# EAGLE schematic 1030-0e (EAGLE 6.0)
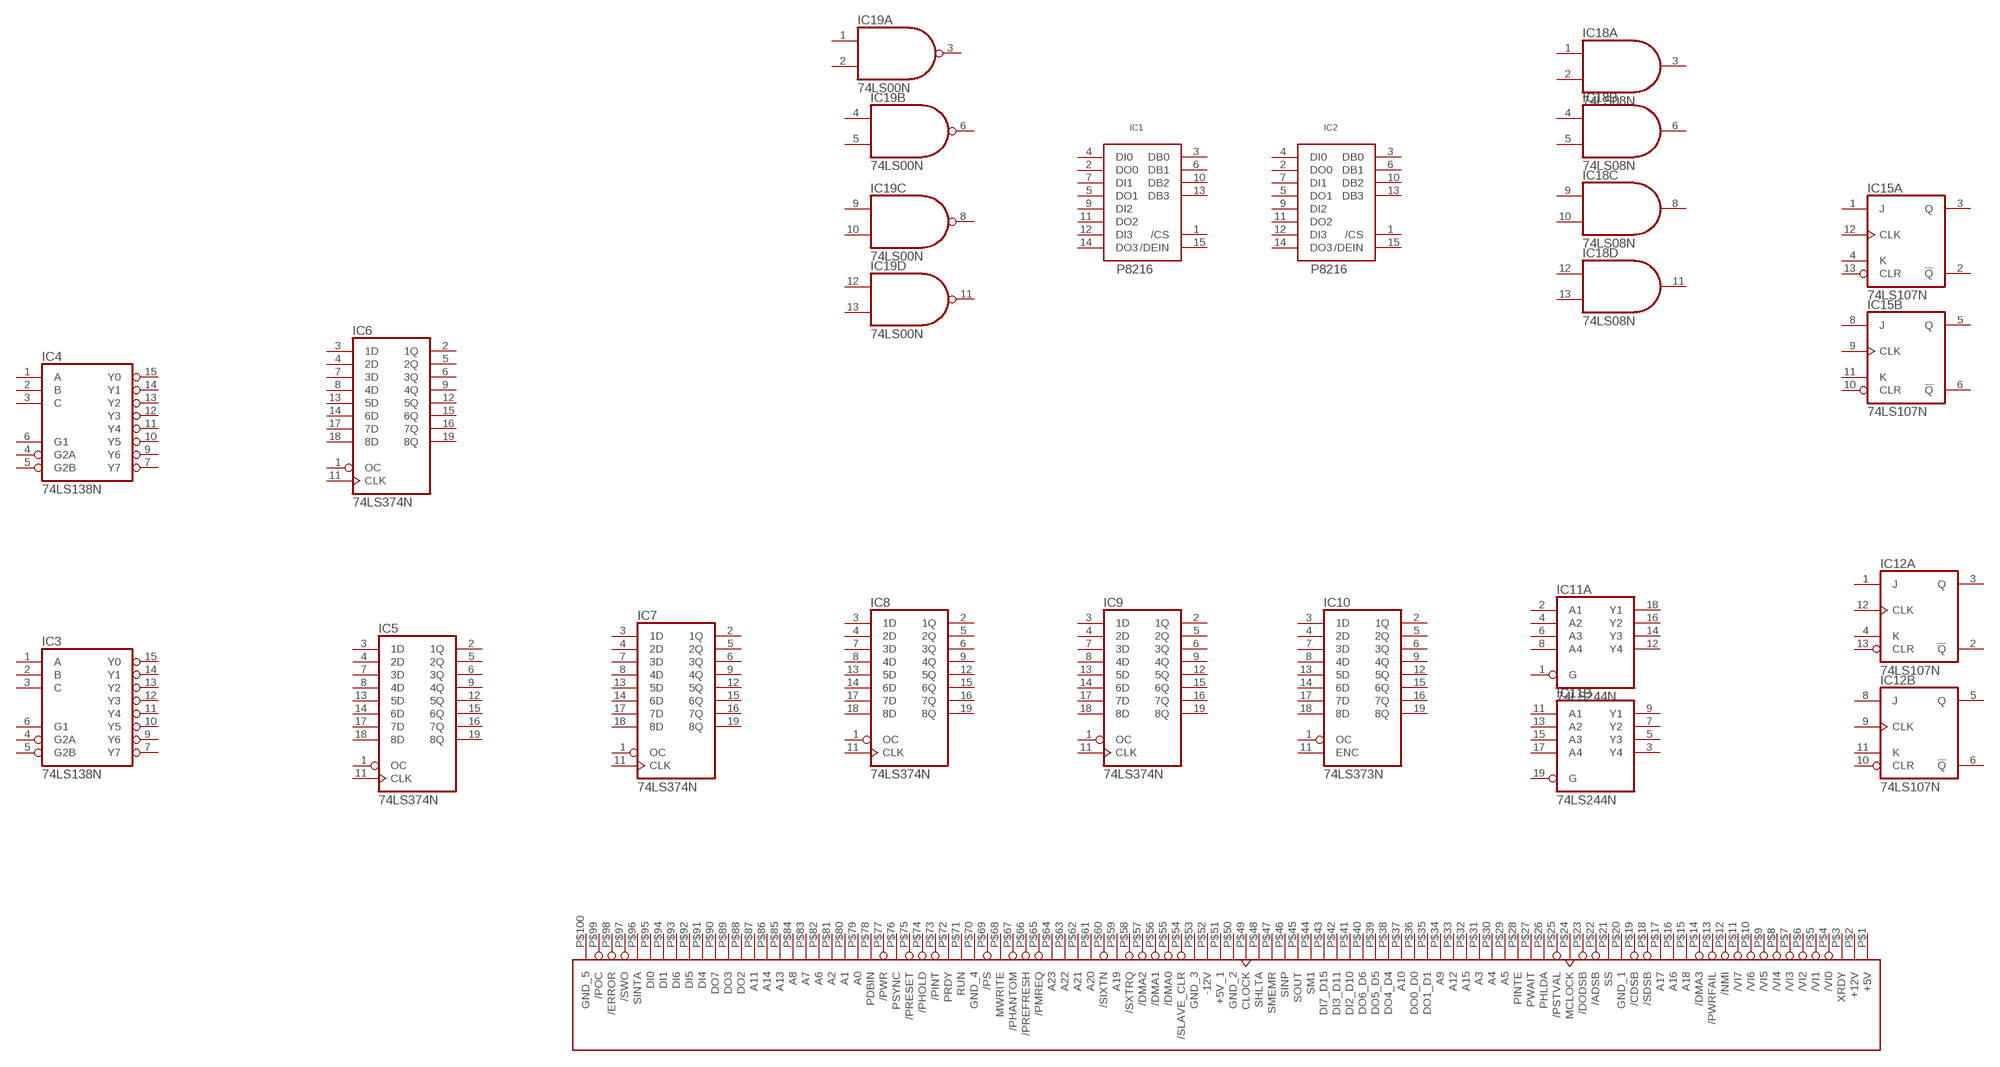
[diagram p0: schematic, sheet 1, part 1 of 2]
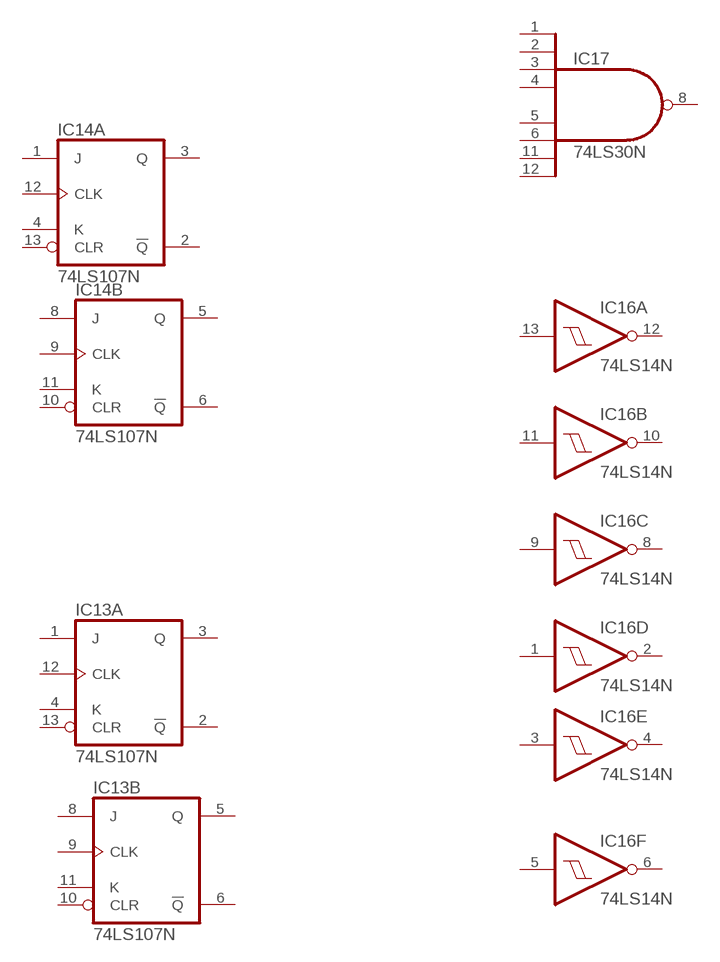
[diagram p1: schematic, sheet 1, part 2 of 2]

## Parts
IC1  P8216  [DIL16]
IC2  P8216  [DIL16]
IC3  74LS138N  [DIL16]
IC4  74LS138N  [DIL16]
IC5  74LS374N  [DIL20]
IC6  74LS374N  [DIL20]
IC7  74LS374N  [DIL20]
IC8  74LS374N  [DIL20]
IC9  74LS374N  [DIL20]
IC10  74LS373N  [DIL20]
IC11  74LS244N  [DIL20]
IC12  74LS107N  [DIL14]
IC13  74LS107N  [DIL14]
IC14  74LS107N  [DIL14]
IC15  74LS107N  [DIL14]
IC16  74LS14N  [DIL14]
IC17  74LS30N  [DIL14]
IC18  74LS08N  [DIL14]
IC19  74LS00N  [DIL14]
U$1  S100_MALE  [S100_MALE]
Unconnected: IC1.1(/CS) IC1.2(DO0) IC1.3(DB0) IC1.4(DI0) IC1.5(DO1) IC1.6(DB1) IC1.7(DI1) IC1.9(DI2) IC1.10(DB2) IC1.11(DO2) IC1.12(DI3) IC1.13(DB3) IC1.14(DO3) IC1.15(/DEIN) IC2.1(/CS) IC2.2(DO0) IC2.3(DB0) IC2.4(DI0) IC2.5(DO1) IC2.6(DB1) IC2.7(DI1) IC2.9(DI2) IC2.10(DB2) IC2.11(DO2) IC2.12(DI3) IC2.13(DB3) IC2.14(DO3) IC2.15(/DEIN) IC3.1(A) IC3.2(B) IC3.3(C) IC3.4(G2A) IC3.5(G2B) IC3.6(G1) IC3.7(Y7) IC3.9(Y6) IC3.10(Y5) IC3.11(Y4) IC3.12(Y3) IC3.13(Y2) IC3.14(Y1) IC3.15(Y0) IC4.1(A) IC4.2(B) IC4.3(C) IC4.4(G2A) IC4.5(G2B) IC4.6(G1) IC4.7(Y7) IC4.9(Y6) IC4.10(Y5) IC4.11(Y4) IC4.12(Y3) IC4.13(Y2) IC4.14(Y1) IC4.15(Y0) IC5.1(OC) IC5.2(1Q) IC5.3(1D) IC5.4(2D) IC5.5(2Q) IC5.6(3Q) IC5.7(3D) IC5.8(4D) IC5.9(4Q) IC5.11(CLK) IC5.12(5Q) IC5.13(5D) IC5.14(6D) IC5.15(6Q) IC5.16(7Q) IC5.17(7D) IC5.18(8D) IC5.19(8Q) IC6.1(OC) IC6.2(1Q) IC6.3(1D) IC6.4(2D) IC6.5(2Q) IC6.6(3Q) IC6.7(3D) IC6.8(4D) IC6.9(4Q) IC6.11(CLK) IC6.12(5Q) IC6.13(5D) IC6.14(6D) IC6.15(6Q) IC6.16(7Q) IC6.17(7D) IC6.18(8D) IC6.19(8Q) IC7.1(OC) IC7.2(1Q) IC7.3(1D) IC7.4(2D) IC7.5(2Q) IC7.6(3Q) IC7.7(3D) IC7.8(4D) IC7.9(4Q) IC7.11(CLK) IC7.12(5Q) IC7.13(5D) IC7.14(6D) IC7.15(6Q) IC7.16(7Q) IC7.17(7D) IC7.18(8D) IC7.19(8Q) IC8.1(OC) IC8.2(1Q) IC8.3(1D) IC8.4(2D) IC8.5(2Q) IC8.6(3Q) IC8.7(3D) IC8.8(4D) IC8.9(4Q) IC8.11(CLK) IC8.12(5Q) IC8.13(5D) IC8.14(6D) IC8.15(6Q) IC8.16(7Q) IC8.17(7D) IC8.18(8D) IC8.19(8Q) IC9.1(OC) IC9.2(1Q) IC9.3(1D) IC9.4(2D) IC9.5(2Q) IC9.6(3Q) IC9.7(3D) IC9.8(4D) IC9.9(4Q) IC9.11(CLK) IC9.12(5Q) IC9.13(5D) IC9.14(6D) IC9.15(6Q) IC9.16(7Q) IC9.17(7D) IC9.18(8D) IC9.19(8Q) IC10.1(OC) IC10.2(1Q) IC10.3(1D) IC10.4(2D) IC10.5(2Q) IC10.6(3Q) IC10.7(3D) IC10.8(4D) IC10.9(4Q) IC10.11(ENC) IC10.12(5Q) IC10.13(5D) IC10.14(6D) IC10.15(6Q) IC10.16(7Q) IC10.17(7D) IC10.18(8D) IC10.19(8Q) IC11.1(A:G) IC11.2(A:A1) IC11.3(B:Y4) IC11.4(A:A2) IC11.5(B:Y3) IC11.6(A:A3) IC11.7(B:Y2) IC11.8(A:A4) IC11.9(B:Y1) IC11.11(B:A1) IC11.12(A:Y4) IC11.13(B:A2) IC11.14(A:Y3) IC11.15(B:A3) IC11.16(A:Y2) IC11.17(B:A4) IC11.18(A:Y1) IC11.19(B:G) IC12.1(A:J) IC12.2(A:!Q) IC12.3(A:Q) IC12.4(A:K) IC12.5(B:Q) IC12.6(B:!Q) IC12.8(B:J) IC12.9(B:CLK) IC12.10(B:CLR) IC12.11(B:K) IC12.12(A:CLK) IC12.13(A:CLR) IC13.1(A:J) IC13.2(A:!Q) IC13.3(A:Q) IC13.4(A:K) IC13.5(B:Q) IC13.6(B:!Q) IC13.8(B:J) IC13.9(B:CLK) IC13.10(B:CLR) IC13.11(B:K) IC13.12(A:CLK) IC13.13(A:CLR) IC14.1(A:J) IC14.2(A:!Q) IC14.3(A:Q) IC14.4(A:K) IC14.5(B:Q) IC14.6(B:!Q) IC14.8(B:J) IC14.9(B:CLK) IC14.10(B:CLR) IC14.11(B:K) IC14.12(A:CLK) IC14.13(A:CLR) IC15.1(A:J) IC15.2(A:!Q) IC15.3(A:Q) IC15.4(A:K) IC15.5(B:Q) IC15.6(B:!Q) IC15.8(B:J) IC15.9(B:CLK) IC15.10(B:CLR) IC15.11(B:K) IC15.12(A:CLK) IC15.13(A:CLR) IC16.1(D:I) IC16.2(D:O) IC16.3(E:I) IC16.4(E:O) IC16.5(F:I) IC16.6(F:O) IC16.8(C:O) IC16.9(C:I) IC16.10(B:O) IC16.11(B:I) IC16.12(A:O) IC16.13(A:I) IC17.1(I0) IC17.2(I1) IC17.3(I2) IC17.4(I3) IC17.5(I4) IC17.6(I5) IC17.8(O) IC17.11(I6) IC17.12(I7) IC18.1(A:I0) IC18.2(A:I1) IC18.3(A:O) IC18.4(B:I0) IC18.5(B:I1) IC18.6(B:O) IC18.8(C:O) IC18.9(C:I0) IC18.10(C:I1) IC18.11(D:O) IC18.12(D:I0) IC18.13(D:I1) IC19.1(A:I0) IC19.2(A:I1) IC19.3(A:O) IC19.4(B:I0) IC19.5(B:I1) IC19.6(B:O) IC19.8(C:O) IC19.9(C:I0) IC19.10(C:I1) IC19.11(D:O) IC19.12(D:I0) IC19.13(D:I1) U$1.P$3(XRDY) U$1.P$4(/VI0) U$1.P$5(/VI1) U$1.P$6(/VI2) U$1.P$7(/VI3) U$1.P$8(/VI4) U$1.P$9(/VI5) U$1.P$10(/VI6) U$1.P$11(/VI7) U$1.P$12(/NMI) U$1.P$13(/PWRFAIL) U$1.P$14(/DMA3) U$1.P$15(A18) U$1.P$16(A16) U$1.P$17(A17) U$1.P$18(/SDSB) U$1.P$19(/CDSB) U$1.P$21(SS) U$1.P$22(/ADSB) U$1.P$23(/DODSB) U$1.P$24(MCLOCK) U$1.P$25(/PSTVAL) U$1.P$26(PHLDA) U$1.P$27(PWAIT) U$1.P$28(PINTE) U$1.P$29(A5) U$1.P$30(A4) U$1.P$31(A3) U$1.P$32(A15) U$1.P$33(A12) U$1.P$34(A9) U$1.P$35(DO1_D1) U$1.P$36(DO0_D0) U$1.P$37(A10) U$1.P$38(DO4_D4) U$1.P$39(DO5_D5) U$1.P$40(DO6_D6) U$1.P$41(DI2_D10) U$1.P$42(DI3_D11) U$1.P$43(DI7_D15) U$1.P$44(SM1) U$1.P$45(SOUT) U$1.P$46(SINP) U$1.P$47(SMEMR) U$1.P$48(SHLTA) U$1.P$49(CLOCK) U$1.P$54(/SLAVE_CLR) U$1.P$55(/DMA0) U$1.P$56(/DMA1) U$1.P$57(/DMA2) U$1.P$58(/SXTRQ) U$1.P$59(A19) U$1.P$60(/SIXTN) U$1.P$61(A20) U$1.P$62(A21) U$1.P$63(A22) U$1.P$64(A23) U$1.P$65(/PMREQ) U$1.P$66(/PREFRESH) U$1.P$67(/PHANTOM) U$1.P$68(MWRITE) U$1.P$69(/PS) U$1.P$71(RUN) U$1.P$72(PRDY) U$1.P$73(/PINT) U$1.P$74(/PHOLD) U$1.P$75(/PRESET) U$1.P$76(PSYNC) U$1.P$77(/PWR) U$1.P$78(PDBIN) U$1.P$79(A0) U$1.P$80(A1) U$1.P$81(A2) U$1.P$82(A6) U$1.P$83(A7) U$1.P$84(A8) U$1.P$85(A13) U$1.P$86(A14) U$1.P$87(A11) U$1.P$88(DO2) U$1.P$89(DO3) U$1.P$90(DO7) U$1.P$91(DI4) U$1.P$92(DI5) U$1.P$93(DI6) U$1.P$94(DI1) U$1.P$95(DI0) U$1.P$96(SINTA) U$1.P$97(/SWO) U$1.P$98(/ERROR) U$1.P$99(/POC)

## Power pins joined to a net without a drawn wire
+5V: U$1.P$1(+5V)
+5V_1: U$1.P$51(+5V_1)
+12V: U$1.P$2(+12V)
-12V: U$1.P$52(-12V)
GND: IC1.8(GND) IC2.8(GND) IC3.8(GND) IC4.8(GND) IC5.10(GND) IC6.10(GND) IC7.10(GND) IC8.10(GND) IC9.10(GND) IC10.10(GND) IC11.10(P:GND) IC12.7(P:GND) IC13.7(P:GND) IC14.7(P:GND) IC15.7(P:GND) IC16.7(P:GND) IC17.7(GND) IC18.7(P:GND) IC19.7(P:GND)
GND_1: U$1.P$20(GND_1)
GND_2: U$1.P$50(GND_2)
GND_3: U$1.P$53(GND_3)
GND_4: U$1.P$70(GND_4)
GND_5: U$1.P$100(GND_5)
VCC: IC1.16(VCC) IC2.16(VCC) IC3.16(VCC) IC4.16(VCC) IC5.20(VCC) IC6.20(VCC) IC7.20(VCC) IC8.20(VCC) IC9.20(VCC) IC10.20(VCC) IC11.20(P:VCC) IC12.14(P:VCC) IC13.14(P:VCC) IC14.14(P:VCC) IC15.14(P:VCC) IC16.14(P:VCC) IC17.14(VCC) IC18.14(P:VCC) IC19.14(P:VCC)

## Library data of the parts
IC1 IC2 = s100:P8216
IC3 IC4 = 74xx-us:74*138: 3-line to 8-line DECODER/DEMULTIPLEXER
IC5-IC9 = 74xx-us:74*374: Octal D type transparent LATCH, edge triggered
IC10 = 74xx-us:74*373: Octal D type transparent LATCH, edge triggered
IC11 = 74xx-us:74*244: Octal BUFFER and LINE DRIVER, 3-state
IC12-IC15 = 74xx-us:74*107: Dual J-K FLIP FLOP, clear
IC16 = 74xx-us:74*14: Hex schmitt trigger INVERTER
IC17 = 74xx-us:74*30: 8-input NAND gate
IC18 = 74xx-us:74*08: Quad 2-input AND gate
IC19 = 74xx-us:74*00: Quad 2-input NAND gate
U$1 = s100:S100_MALE